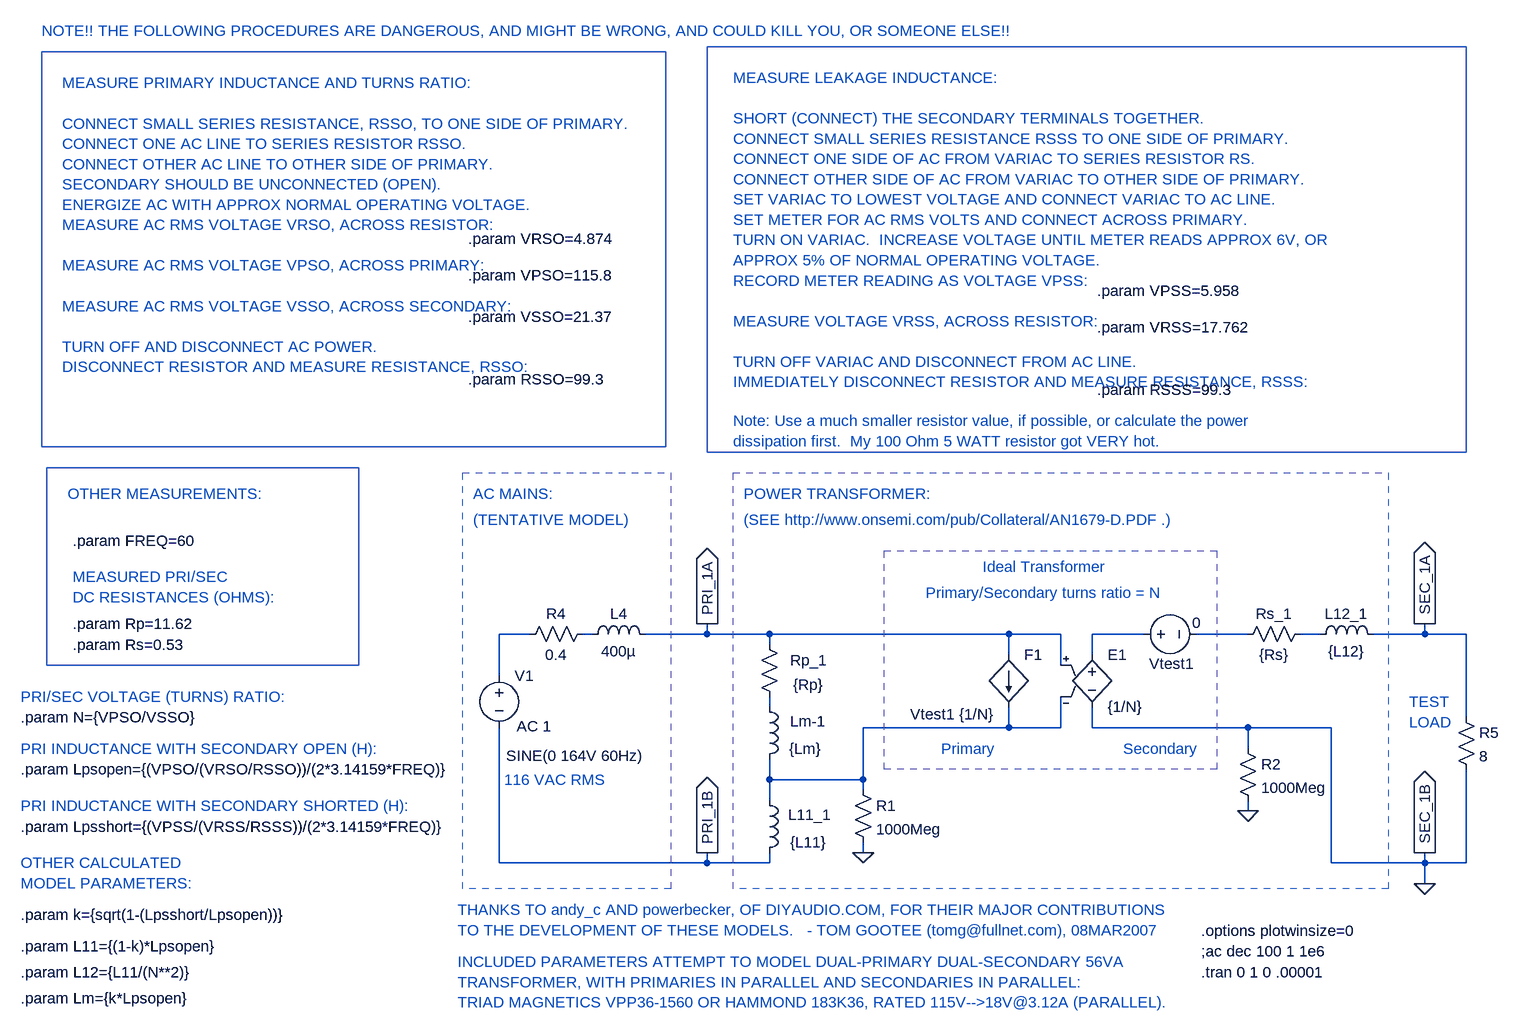
[diagram p0: schematic xfmrmeas.asc]
xfmrmeas.asc, the LTspice schematic file:
Version 4
SHEET 1 1092 744
WIRE -720 160 -768 160
WIRE -624 160 -640 160
WIRE -448 160 -448 144
WIRE -448 160 -544 160
WIRE -352 160 -448 160
WIRE 16 160 -352 160
WIRE 96 160 16 160
WIRE 224 160 144 160
WIRE 384 160 304 160
WIRE 496 160 464 160
WIRE 656 160 656 144
WIRE 656 160 576 160
WIRE 720 160 656 160
WIRE -352 176 -352 160
WIRE 16 192 16 160
WIRE 144 192 144 160
WIRE 96 208 96 160
WIRE -768 224 -768 160
WIRE -352 272 -352 256
WIRE 720 288 720 160
WIRE 16 304 16 272
WIRE 16 304 -208 304
WIRE 96 304 96 256
WIRE 96 304 16 304
WIRE 144 304 144 272
WIRE 384 304 144 304
WIRE 512 304 384 304
WIRE 384 336 384 304
WIRE -352 384 -352 352
WIRE -208 384 -208 304
WIRE -208 384 -352 384
WIRE -208 400 -208 384
WIRE -352 416 -352 384
WIRE 384 432 384 416
WIRE -208 496 -208 480
WIRE -768 512 -768 304
WIRE -448 512 -448 496
WIRE -448 512 -768 512
WIRE -352 512 -352 496
WIRE -352 512 -448 512
WIRE 512 512 512 304
WIRE 656 512 656 496
WIRE 656 512 512 512
WIRE 720 512 720 368
WIRE 720 512 656 512
WIRE 656 544 656 512
FLAG 384 432 0
FLAG -208 496 0
FLAG 656 544 0
FLAG -448 144 PRI_1A
IOPIN -448 144 Out
FLAG -448 496 PRI_1B
IOPIN -448 496 Out
FLAG 656 144 SEC_1A
IOPIN 656 144 Out
FLAG 656 496 SEC_1B
IOPIN 656 496 Out
SYMBOL f 16 192 R0
WINDOW 3 -152 91 Left 0
SYMATTR Value Vtest1 {1/N}
SYMATTR InstName F1
SYMBOL voltage 208 160 R270
WINDOW 0 -61 58 VTop 0
WINDOW 3 33 97 VBottom 0
SYMATTR InstName Vtest1
SYMATTR Value 0
SYMBOL e 144 176 R0
SYMATTR InstName E1
SYMATTR Value {1/N}
SYMBOL voltage -768 208 R0
WINDOW 123 27 94 Left 0
WINDOW 39 0 0 Left 0
WINDOW 3 11 139 Left 0
SYMATTR Value2 AC 1
SYMATTR Value SINE(0 164V 60Hz)
SYMATTR InstName V1
SYMBOL res 368 320 R0
SYMATTR InstName R2
SYMATTR Value 1000Meg
SYMBOL res -368 160 R0
WINDOW 0 48 40 Left 0
WINDOW 3 52 78 Left 0
SYMATTR InstName Rp_1
SYMATTR Value {Rp}
SYMBOL ind -368 256 R0
WINDOW 0 48 38 Left 0
WINDOW 3 46 80 Left 0
SYMATTR InstName Lm-1
SYMATTR Value {Lm}
SYMBOL ind -368 400 R0
WINDOW 0 45 38 Left 0
WINDOW 3 48 80 Left 0
SYMATTR InstName L11_1
SYMATTR Value {L11}
SYMBOL res 480 144 R90
WINDOW 0 0 56 VBottom 0
WINDOW 3 32 56 VTop 0
SYMATTR InstName Rs_1
SYMATTR Value {Rs}
SYMBOL ind 480 176 R270
WINDOW 0 32 56 VTop 0
WINDOW 3 5 56 VBottom 0
SYMATTR InstName L12_1
SYMATTR Value {L12}
SYMBOL res -624 144 R90
WINDOW 0 0 56 VBottom 0
WINDOW 3 32 56 VTop 0
SYMATTR InstName R4
SYMATTR Value 0.4
SYMBOL ind -640 176 R270
WINDOW 0 32 56 VTop 0
WINDOW 3 5 56 VBottom 0
SYMATTR InstName L4
SYMATTR Value 400µ
SYMBOL res 704 272 R0
SYMATTR InstName R5
SYMATTR Value 8
SYMBOL res -224 384 R0
SYMATTR InstName R1
SYMATTR Value 1000Meg
TEXT -24 56 Left 0 ;Ideal Transformer
TEXT -112 96 Left 0 ;Primary/Secondary turns ratio = N
TEXT 312 648 Left 0 !;ac dec 100 1 1e6
TEXT -1504 288 Left 0 !.param N={VPSO/VSSO}
TEXT -88 336 Left 0 ;Primary
TEXT 192 336 Left 0 ;Secondary
TEXT 312 680 Left 0 !.tran 0 1 0 .00001
TEXT -832 664 Left 0 ;INCLUDED PARAMETERS ATTEMPT TO MODEL DUAL-PRIMARY DUAL-SECONDARY 56VA\nTRANSFORMER, WITH PRIMARIES IN PARALLEL AND SECONDARIES IN PARALLEL:\nTRIAD MAGNETICS VPP36-1560 OR HAMMOND 183K36, RATED 115V-->18V@3.12A (PARALLEL).
TEXT -808 -56 Left 0 ;AC MAINS:
TEXT -392 -56 Left 0 ;POWER TRANSFORMER:
TEXT -832 584 Left 0 ;THANKS TO andy_c AND powerbecker, OF DIYAUDIO.COM, FOR THEIR MAJOR CONTRIBUTIONS\nTO THE DEVELOPMENT OF THESE MODELS.   - TOM GOOTEE (tomg@fullnet.com), 08MAR2007
TEXT -1424 144 Left 0 !.param Rp=11.62
TEXT -1424 176 Left 0 !.param Rs=0.53
TEXT -1504 720 Left 0 !.param Lm={k*Lpsopen}
TEXT -1504 640 Left 0 !.param L11={(1-k)*Lpsopen}
TEXT -1504 680 Left 0 !.param L12={L11/(N**2)}
TEXT -392 -16 Left 0 ;(SEE http://www.onsemi.com/pub/Collateral/AN1679-D.PDF .)
TEXT -808 -16 Left 0 ;(TENTATIVE MODEL)
TEXT 312 616 Left 0 !.options plotwinsize=0
TEXT -1504 368 Left 0 !.param Lpsopen={(VPSO/(VRSO/RSSO))/(2*3.14159*FREQ)}
TEXT -1504 592 Left 0 !.param k={sqrt(1-(Lpsshort/Lpsopen))}
TEXT -1504 256 Left 0 ;PRI/SEC VOLTAGE (TURNS) RATIO:
TEXT -1424 72 Left 0 ;MEASURED PRI/SEC\nDC RESISTANCES (OHMS):
TEXT -1504 336 Left 0 ;PRI INDUCTANCE WITH SECONDARY OPEN (H):
TEXT -1504 424 Left 0 ;PRI INDUCTANCE WITH SECONDARY SHORTED (H):
TEXT -1504 512 Left 0 ;OTHER CALCULATED\nMODEL PARAMETERS:
TEXT 632 264 Left 0 ;TEST\nLOAD
TEXT -1440 -688 Left 0 ;MEASURE PRIMARY INDUCTANCE AND TURNS RATIO:\n \nCONNECT SMALL SERIES RESISTANCE, RSSO, TO ONE SIDE OF PRIMARY.\nCONNECT ONE AC LINE TO SERIES RESISTOR RSSO.\nCONNECT OTHER AC LINE TO OTHER SIDE OF PRIMARY.\nSECONDARY SHOULD BE UNCONNECTED (OPEN).\nENERGIZE AC WITH APPROX NORMAL OPERATING VOLTAGE.\nMEASURE AC RMS VOLTAGE VRSO, ACROSS RESISTOR:\n \nMEASURE AC RMS VOLTAGE VPSO, ACROSS PRIMARY:\n \nMEASURE AC RMS VOLTAGE VSSO, ACROSS SECONDARY:\n \nTURN OFF AND DISCONNECT AC POWER.\nDISCONNECT RESISTOR AND MEASURE RESISTANCE, RSSO:
TEXT -408 -696 Left 0 ;MEASURE LEAKAGE INDUCTANCE:\n \nSHORT (CONNECT) THE SECONDARY TERMINALS TOGETHER.\nCONNECT SMALL SERIES RESISTANCE RSSS TO ONE SIDE OF PRIMARY.\nCONNECT ONE SIDE OF AC FROM VARIAC TO SERIES RESISTOR RS.\nCONNECT OTHER SIDE OF AC FROM VARIAC TO OTHER SIDE OF PRIMARY.\nSET VARIAC TO LOWEST VOLTAGE AND CONNECT VARIAC TO AC LINE.\nSET METER FOR AC RMS VOLTS AND CONNECT ACROSS PRIMARY.\nTURN ON VARIAC.  INCREASE VOLTAGE UNTIL METER READS APPROX 6V, OR\nAPPROX 5% OF NORMAL OPERATING VOLTAGE.\nRECORD METER READING AS VOLTAGE VPSS:\n \nMEASURE VOLTAGE VRSS, ACROSS RESISTOR:\n \nTURN OFF VARIAC AND DISCONNECT FROM AC LINE.\nIMMEDIATELY DISCONNECT RESISTOR AND MEASURE RESISTANCE, RSSS:
TEXT -1424 16 Left 0 !.param FREQ=60
TEXT 152 -368 Left 0 !.param VPSS=5.958
TEXT 152 -312 Left 0 !.param VRSS=17.762
TEXT 152 -216 Left 0 !.param RSSS=99.3
TEXT -816 -448 Left 0 !.param VRSO=4.874
TEXT -816 -392 Left 0 !.param VPSO=115.8
TEXT -816 -328 Left 0 !.param VSSO=21.37
TEXT -816 -232 Left 0 !.param RSSO=99.3
TEXT -1504 456 Left 0 !.param Lpsshort={(VPSS/(VRSS/RSSS))/(2*3.14159*FREQ)}
TEXT -1432 -56 Left 0 ;OTHER MEASUREMENTS:
TEXT -408 -168 Left 0 ;Note: Use a much smaller resistor value, if possible, or calculate the power\ndissipation first.  My 100 Ohm 5 WATT resistor got VERY hot.
TEXT -760 384 Left 0 ;116 VAC RMS
TEXT -1472 -768 Left 0 ;NOTE!! THE FOLLOWING PROCEDURES ARE DANGEROUS, AND MIGHT BE WRONG, AND COULD KILL YOU, OR SOMEONE ELSE!!
RECTANGLE Normal 336 368 -176 32 2
RECTANGLE Normal 600 552 -408 -88 2
RECTANGLE Normal -504 552 -824 -88 2
RECTANGLE Normal -512 -128 -1472 -736
RECTANGLE Normal 720 -120 -448 -744
RECTANGLE Normal -984 208 -1464 -96

The netlist it stands for:
* xfmrmeas.asc
F1 PRI_1A N007 Vtest1 {1/N}
Vtest1 N003 N004 0
E1 N003 0 PRI_1A N007 {1/N}
V1 N001 PRI_1B SINE(0 164V 60Hz) AC 1
R2 0 0 1000Meg
Rp_1 PRI_1A N006 {Rp}
Lm-1 N006 N007 {Lm}
L11_1 N007 PRI_1B {L11}
Rs_1 N005 N004 {Rs}
L12_1 N005 SEC_1A {L12}
R4 N002 N001 0.4
L4 N002 PRI_1A 400µ
R5 SEC_1A 0 8
R1 N007 0 1000Meg
* Ideal Transformer
* Primary/Secondary turns ratio = N
;ac dec 100 1 1e6
.param N={VPSO/VSSO}
* Primary
* Secondary
.tran 0 1 0 .00001
* INCLUDED PARAMETERS ATTEMPT TO MODEL DUAL-PRIMARY DUAL-SECONDARY 56VA
* TRANSFORMER, WITH PRIMARIES IN PARALLEL AND SECONDARIES IN PARALLEL:
* TRIAD MAGNETICS VPP36-1560 OR HAMMOND 183K36, RATED 115V-->18V@3.12A (PARALLEL).
* AC MAINS:
* POWER TRANSFORMER:
* THANKS TO andy_c AND powerbecker, OF DIYAUDIO.COM, FOR THEIR MAJOR CONTRIBUTIONS
* TO THE DEVELOPMENT OF THESE MODELS.   - TOM GOOTEE (tomg@fullnet.com), 08MAR2007
.param Rp=11.62
.param Rs=0.53
.param Lm={k*Lpsopen}
.param L11={(1-k)*Lpsopen}
.param L12={L11/(N**2)}
* (SEE http://www.onsemi.com/pub/Collateral/AN1679-D.PDF .)
* (TENTATIVE MODEL)
.options plotwinsize=0
.param Lpsopen={(VPSO/(VRSO/RSSO))/(2*3.14159*FREQ)}
.param k={sqrt(1-(Lpsshort/Lpsopen))}
* PRI/SEC VOLTAGE (TURNS) RATIO:
* MEASURED PRI/SEC
* DC RESISTANCES (OHMS):
* PRI INDUCTANCE WITH SECONDARY OPEN (H):
* PRI INDUCTANCE WITH SECONDARY SHORTED (H):
* OTHER CALCULATED
* MODEL PARAMETERS:
* TEST
* LOAD
* MEASURE PRIMARY INDUCTANCE AND TURNS RATIO:
* CONNECT SMALL SERIES RESISTANCE, RSSO, TO ONE SIDE OF PRIMARY.
* CONNECT ONE AC LINE TO SERIES RESISTOR RSSO.
* CONNECT OTHER AC LINE TO OTHER SIDE OF PRIMARY.
* SECONDARY SHOULD BE UNCONNECTED (OPEN).
* ENERGIZE AC WITH APPROX NORMAL OPERATING VOLTAGE.
* MEASURE AC RMS VOLTAGE VRSO, ACROSS RESISTOR:
* MEASURE AC RMS VOLTAGE VPSO, ACROSS PRIMARY:
* MEASURE AC RMS VOLTAGE VSSO, ACROSS SECONDARY:
* TURN OFF AND DISCONNECT AC POWER.
* DISCONNECT RESISTOR AND MEASURE RESISTANCE, RSSO:
* MEASURE LEAKAGE INDUCTANCE:
* SHORT (CONNECT) THE SECONDARY TERMINALS TOGETHER.
* CONNECT SMALL SERIES RESISTANCE RSSS TO ONE SIDE OF PRIMARY.
* CONNECT ONE SIDE OF AC FROM VARIAC TO SERIES RESISTOR RS.
* CONNECT OTHER SIDE OF AC FROM VARIAC TO OTHER SIDE OF PRIMARY.
* SET VARIAC TO LOWEST VOLTAGE AND CONNECT VARIAC TO AC LINE.
* SET METER FOR AC RMS VOLTS AND CONNECT ACROSS PRIMARY.
* TURN ON VARIAC.  INCREASE VOLTAGE UNTIL METER READS APPROX 6V, OR
* APPROX 5% OF NORMAL OPERATING VOLTAGE.
* RECORD METER READING AS VOLTAGE VPSS:
* MEASURE VOLTAGE VRSS, ACROSS RESISTOR:
* TURN OFF VARIAC AND DISCONNECT FROM AC LINE.
* IMMEDIATELY DISCONNECT RESISTOR AND MEASURE RESISTANCE, RSSS:
.param FREQ=60
.param VPSS=5.958
.param VRSS=17.762
.param RSSS=99.3
.param VRSO=4.874
.param VPSO=115.8
.param VSSO=21.37
.param RSSO=99.3
.param Lpsshort={(VPSS/(VRSS/RSSS))/(2*3.14159*FREQ)}
* OTHER MEASUREMENTS:
* Note: Use a much smaller resistor value, if possible, or calculate the power
* dissipation first.  My 100 Ohm 5 WATT resistor got VERY hot.
* 116 VAC RMS
* NOTE!! THE FOLLOWING PROCEDURES ARE DANGEROUS, AND MIGHT BE WRONG, AND COULD KILL YOU, OR SOMEONE ELSE!!
.backanno
.end